# EAGLE schematic mcb_com14 (EAGLE 5.09)
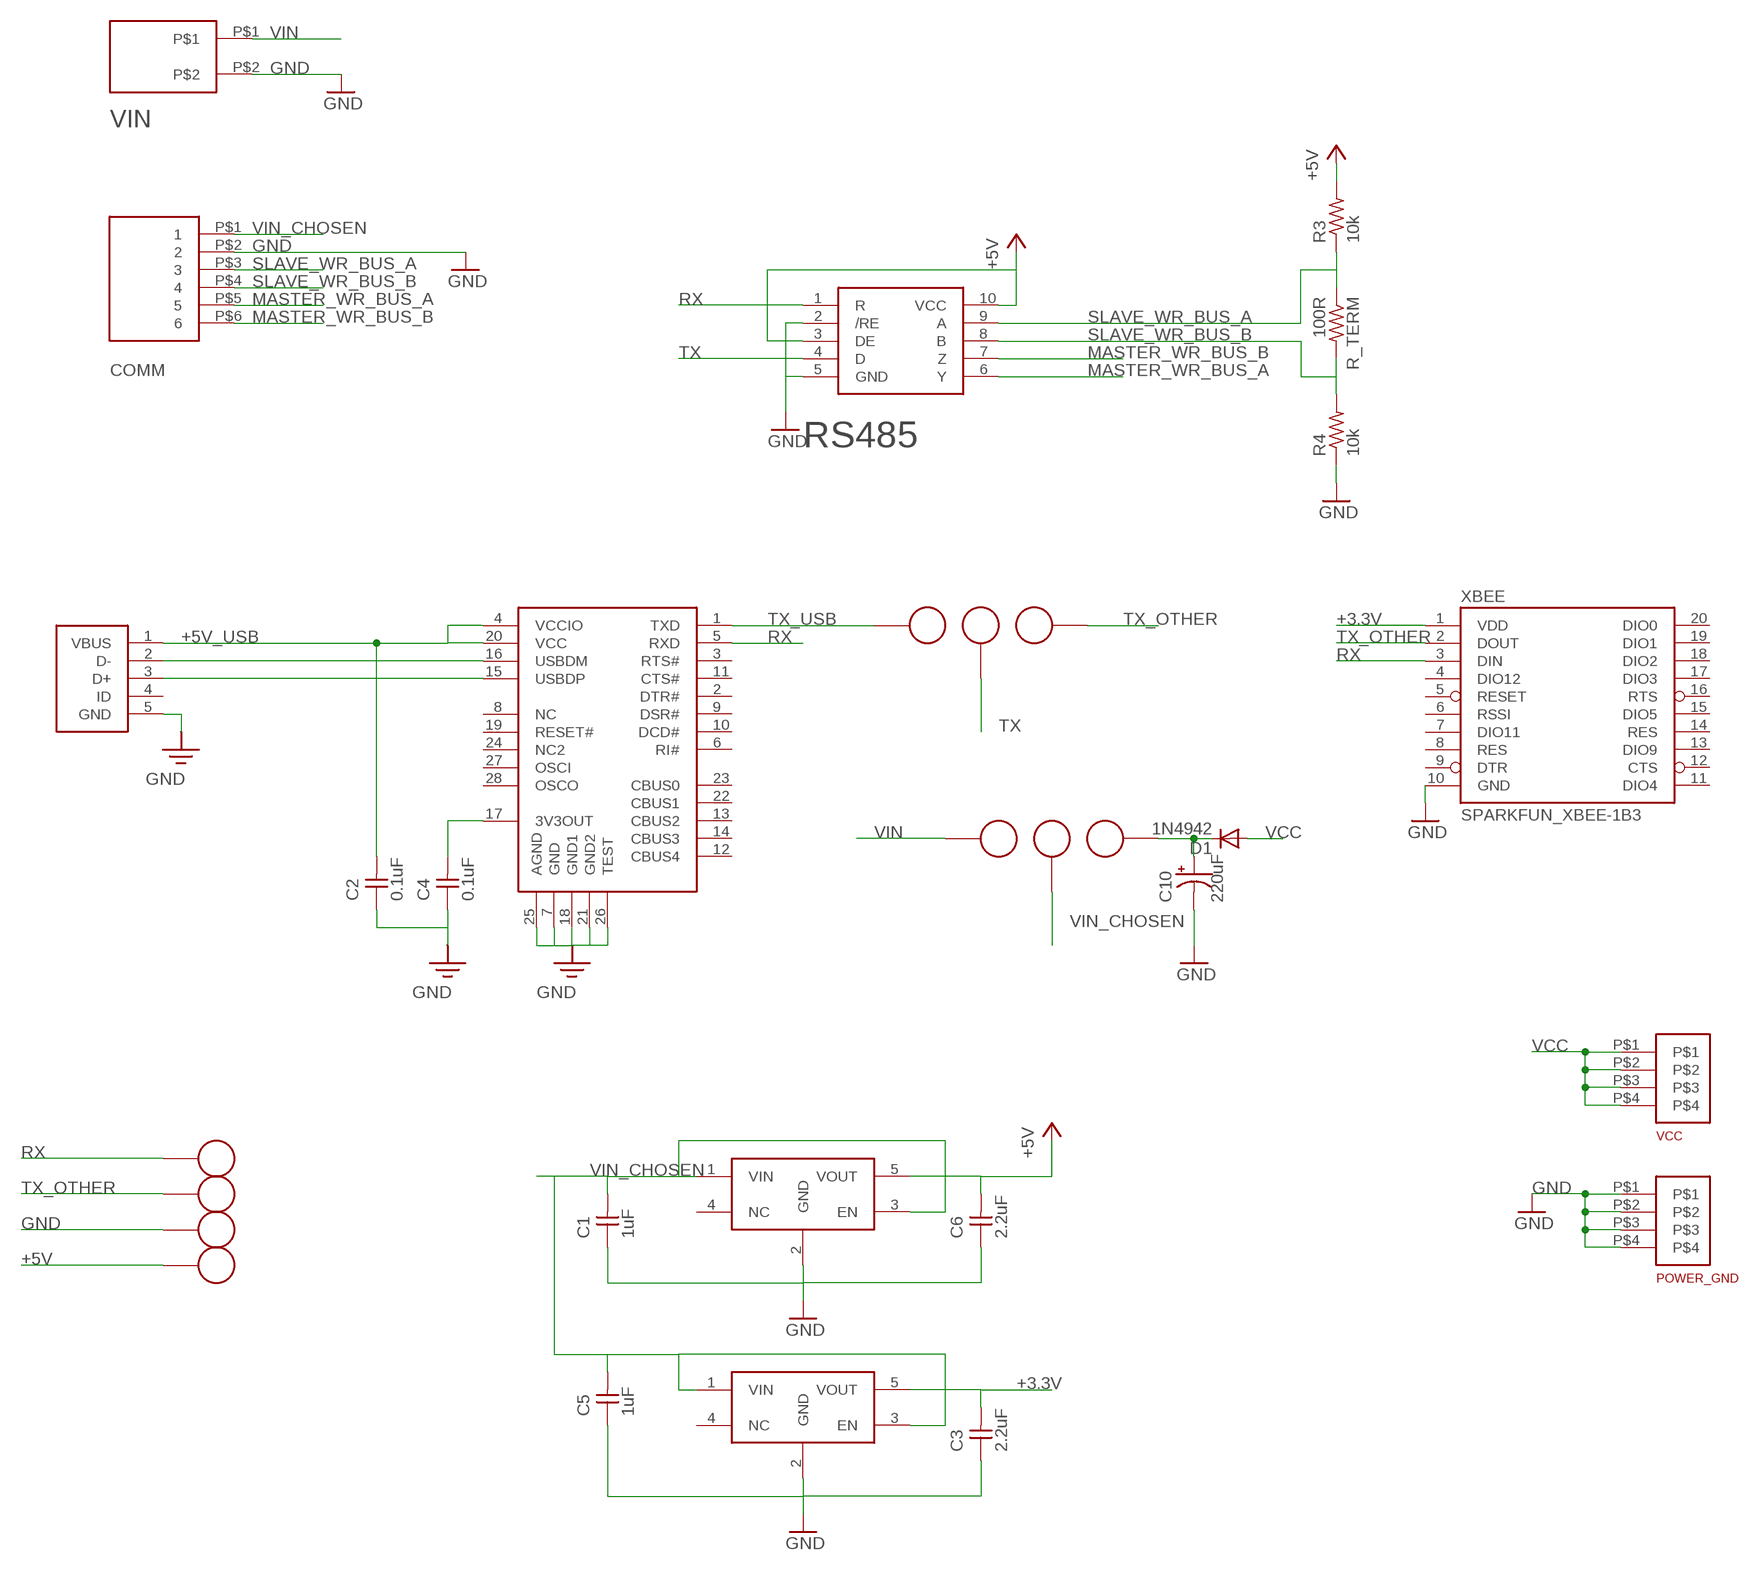
[diagram p0: schematic, sheet 1]

## Parts
3.3V_REG  MIC5235  [SOT-23-5]
5V1  CONNECTOR_TV  [CONNECTOR_TV]
5V_REG  MIC5235  [SOT-23-5]
5V_USB1  CONNECTOR_TV  [CONNECTOR_TV]
5V_VREG1  CONNECTOR_TV  [CONNECTOR_TV]
+5V  CONNECTOR_TV  [CONNECTOR_TV]
C1  1uF  CAPACITOR0805  [0805@1]
C2  0.1uF  CAPACITOR0805  [0805@1]
C3  2.2uF  CAPACITOR0805  [0805@1]
C4  0.1uF  CAPACITOR0805  [0805@1]
C5  1uF  CAPACITOR0805  [0805@1]
C6  2.2uF  CAPACITOR0805  [0805@1]
C10  220uF  CAP-EMVY350ADA221MHA0G  [HAO]
COMM  6PIN-RIBBONCABLE-BOARDHEADER  [6PIN-HEADER-DUALROW]
D1  1N4942  [DO41-10]
FT323R  FT232R  [SSOP-28]
GND  CONNECTOR_TV  [CONNECTOR_TV]
POWER_GND  SCREW_TERMINAL_7700K  [SCREW_TERM_7700K]
R3  10k  RESISTOR0603  [0603]
R4  10k  RESISTOR0603  [0603]
R_TERM  100R  RESISTOR0603  [0603]
RS485  RS485-SN65HVD3086EDGSR  [MSOP-10]
RX1  CONNECTOR_TV  [CONNECTOR_TV]
TX  CONNECTOR_TV  [CONNECTOR_TV]
TX1  CONNECTOR_TV  [CONNECTOR_TV]
TX_FTDI  CONNECTOR_TV  [CONNECTOR_TV]
TX_TTL  CONNECTOR_TV  [CONNECTOR_TV]
USB_CONN  MINIUSB  [UX60-MINI-USB]
VCC  SCREW_TERMINAL_7700K  [SCREW_TERM_7700K]
VIN  2PIN-3.81MM-TERMINAL-BLOCK  [2PIN-TERMINAL-BLOCK-SMALLER]
XBEE  SPARKFUN_XBEE-1B3  [SPARKFUN_XBEE-SMD]

## Nets
+3.3V: 3.3V_REG.5(VOUT) C3.2 XBEE.1(VDD)
+5V: 5V_REG.5(VOUT) +5V.P$1 C6.2 R3.2 RS485.3(DE) RS485.10(VCC)
+5V_USB: C2.2 FT323R.4(VCCIO) FT323R.20(VCC) USB_CONN.1(VBUS)
D+: FT323R.15(USBDP) USB_CONN.3(D+)
D-: FT323R.16(USBDM) USB_CONN.2(D-)
GND: 3.3V_REG.2(GND) 5V_REG.2(GND) C1.1 C2.1 C3.1 C4.1 C5.1 C6.1 C10.- COMM.P$2 FT323R.7(GND) FT323R.18(GND1) FT323R.21(GND2) FT323R.25(AGND) FT323R.26(TEST) GND.P$1 POWER_GND.P$1 POWER_GND.P$2 POWER_GND.P$3 POWER_GND.P$4 R4.1 RS485.2(/RE) RS485.5(GND) USB_CONN.5(GND) VIN.P$2 XBEE.10(GND)
MASTER_WR_BUS_A: COMM.P$5 RS485.6(Y)
MASTER_WR_BUS_B: COMM.P$6 RS485.7(Z)
N$1: 5V_USB1.P$1 C10.+ D1.C
N$4: C4.2 FT323R.17(3V3OUT)
RX: FT323R.5(RXD) RS485.1(R) RX1.P$1 XBEE.3(DIN)
SLAVE_WR_BUS_A: COMM.P$3 R3.1 R_TERM.1 RS485.9(A)
SLAVE_WR_BUS_B: COMM.P$4 R4.2 R_TERM.2 RS485.8(B)
TX: RS485.4(D) TX.P$1
TX_OTHER: TX1.P$1 TX_TTL.P$1 XBEE.2(DOUT)
TX_USB: FT323R.1(TXD) TX_FTDI.P$1
VCC: D1.A VCC.P$1 VCC.P$2 VCC.P$3 VCC.P$4
VIN: 5V_VREG1.P$1 VIN.P$1
VIN_CHOSEN: 3.3V_REG.1(VIN) 3.3V_REG.3(EN) 5V1.P$1 5V_REG.1(VIN) 5V_REG.3(EN) C1.2 C5.2 COMM.P$1
Unconnected: 3.3V_REG.4(NC) 5V_REG.4(NC) FT323R.2(DTR#) FT323R.3(RTS#) FT323R.6(RI#) FT323R.8(NC) FT323R.9(DSR#) FT323R.10(DCD#) FT323R.11(CTS#) FT323R.12(CBUS4) FT323R.13(CBUS2) FT323R.14(CBUS3) FT323R.19(RESET#) FT323R.22(CBUS1) FT323R.23(CBUS0) FT323R.24(NC2) FT323R.27(OSCI) FT323R.28(OSCO) USB_CONN.4(ID) XBEE.4(DIO12) XBEE.5(RESET) XBEE.6(RSSI) XBEE.7(DIO11) XBEE.8(RES) XBEE.9(DTR) XBEE.11(DIO4) XBEE.12(CTS) XBEE.13(DIO9) XBEE.14(RES) XBEE.15(DIO5) XBEE.16(RTS) XBEE.17(DIO3) XBEE.18(DIO2) XBEE.19(DIO1) XBEE.20(DIO0)

## Library data of the parts
3.3V_REG 5V_REG = soa:MIC5235
5V1 5V_USB1 5V_VREG1 +5V GND RX1 TX TX1 TX_FTDI TX_TTL = soa:CONNECTOR_TV
C1-C6 = huggable:CAPACITOR
C10 = soa:CAP-EMVY350ADA221MHA0G
COMM = soa:6PIN-RIBBONCABLE-BOARDHEADER
D1 = diode:1N4942: DIODE 1.0 A, 200 V, 150 ns
FT323R = ftdi:FT232R
POWER_GND VCC = soa:SCREW_TERMINAL_7700K
R3 R4 R_TERM = huggable:RESISTOR
RS485 = soa:RS485-SN65HVD3086EDGSR
USB_CONN = usb:MINIUSB
VIN = soa:2PIN-3.81MM-TERMINAL-BLOCK
XBEE = XBee-Explorer-v15:SPARKFUN_XBEE-1